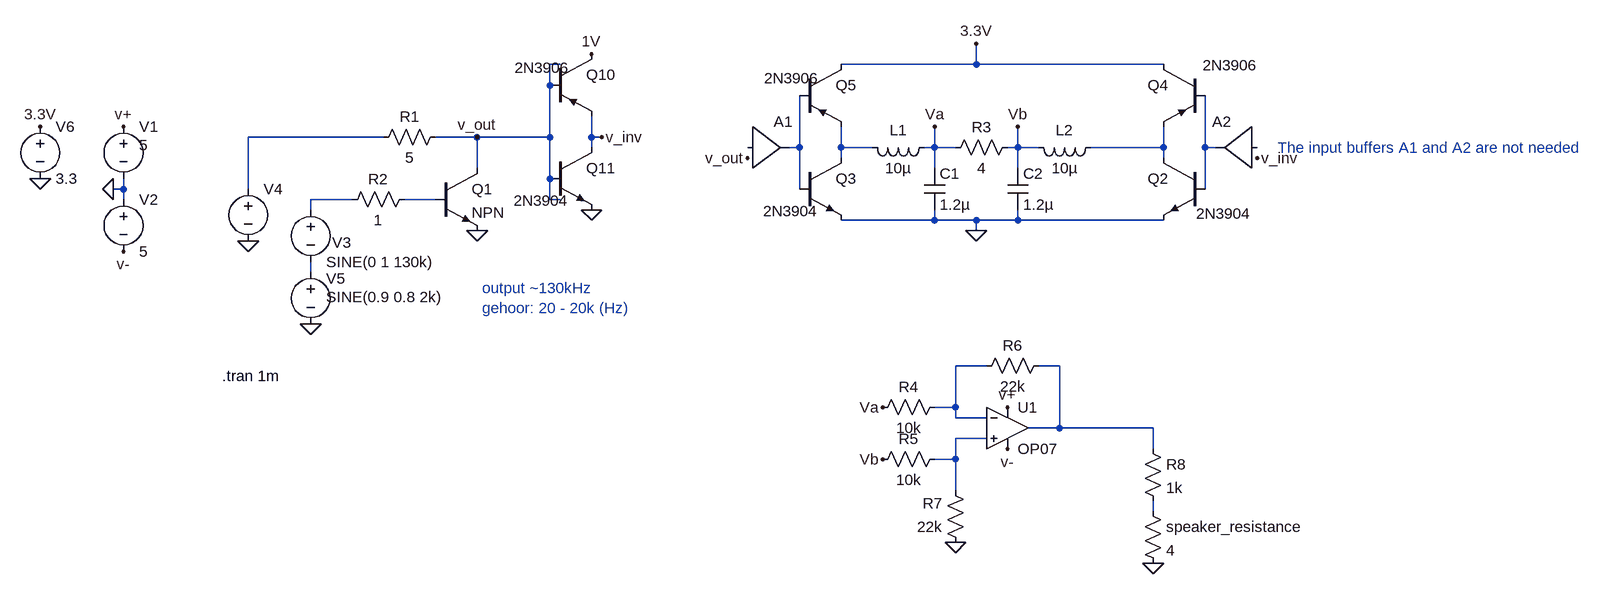
[diagram p0: schematic external filter voor speaker.asc]
external filter voor speaker.asc, the LTspice schematic file:
Version 4
SHEET 1 2196 708
WIRE 480 -144 464 -144
WIRE 1120 -144 1120 -176
WIRE 1120 -144 912 -144
WIRE 1408 -144 1120 -144
WIRE 464 -112 464 -144
WIRE 208 -32 0 -32
WIRE 352 -32 288 -32
WIRE 464 -32 464 -112
WIRE 464 -32 352 -32
WIRE 528 -32 528 -64
WIRE 544 -32 528 -32
WIRE 528 -16 528 -32
WIRE 848 -16 848 -96
WIRE 848 -16 832 -16
WIRE 912 -16 912 -48
WIRE 960 -16 912 -16
WIRE 1056 -16 1056 -48
WIRE 1056 -16 1040 -16
WIRE 1088 -16 1056 -16
WIRE 1184 -16 1184 -48
WIRE 1184 -16 1168 -16
WIRE 1216 -16 1184 -16
WIRE 1408 -16 1408 -48
WIRE 1408 -16 1296 -16
WIRE 1472 -16 1472 -96
WIRE 1488 -16 1472 -16
WIRE 912 0 912 -16
WIRE 1408 0 1408 -16
WIRE 352 16 352 -32
WIRE 1056 16 1056 -16
WIRE 1184 16 1184 -16
WIRE 464 32 464 -32
WIRE -192 48 -192 32
WIRE -192 48 -208 48
WIRE 0 48 0 -32
WIRE 848 48 848 -16
WIRE 1472 48 1472 -16
WIRE -192 64 -192 48
WIRE 160 64 96 64
WIRE 288 64 240 64
WIRE 464 64 464 32
WIRE 480 64 464 64
WIRE 96 80 96 64
WIRE 1056 96 1056 80
WIRE 1056 96 912 96
WIRE 1120 96 1056 96
WIRE 1184 96 1184 80
WIRE 1184 96 1120 96
WIRE 1408 96 1184 96
WIRE 1120 112 1120 96
WIRE 96 176 96 160
WIRE 1136 320 1088 320
WIRE 1248 320 1216 320
WIRE 1088 384 1088 320
WIRE 1088 384 1056 384
WIRE 1088 400 1088 384
WIRE 1136 400 1088 400
WIRE 1248 416 1248 320
WIRE 1248 416 1200 416
WIRE 1392 416 1248 416
WIRE 1136 432 1088 432
WIRE 1392 448 1392 416
WIRE 1088 464 1088 432
WIRE 1088 464 1056 464
WIRE 1088 512 1088 464
WIRE 1392 544 1392 528
FLAG -208 48 0
FLAG -192 -48 v+
FLAG -192 144 v-
FLAG 0 128 0
FLAG 352 112 0
FLAG 96 256 0
FLAG 1120 112 0
FLAG 528 80 0
FLAG 352 -32 v_out
FLAG 768 0 v_out
FLAG 544 -32 v_inv
FLAG 1552 0 v_inv
FLAG 1056 -48 Va
FLAG 1184 -48 Vb
FLAG -320 32 0
FLAG -320 -48 3.3V
FLAG 528 -160 1V
FLAG 1120 -176 3.3V
FLAG 1168 384 v+
FLAG 1168 448 v-
FLAG 1088 592 0
FLAG 976 384 Va
FLAG 976 464 Vb
FLAG 1392 624 0
SYMBOL voltage -192 -64 R0
WINDOW 3 24 44 Left 2
WINDOW 123 0 0 Left 0
WINDOW 39 0 0 Left 0
SYMATTR Value 5
SYMATTR InstName V1
SYMBOL voltage -192 48 R0
WINDOW 123 0 0 Left 0
WINDOW 39 0 0 Left 0
SYMATTR InstName V2
SYMATTR Value 5
SYMBOL voltage 96 64 R0
WINDOW 0 33 66 Left 2
WINDOW 123 0 0 Left 0
WINDOW 39 0 0 Left 0
SYMATTR InstName V3
SYMATTR Value SINE(0 1 130k)
SYMBOL voltage 0 32 R0
WINDOW 3 24 96 Invisible 2
WINDOW 123 0 0 Left 0
SYMATTR Value 4
SYMATTR InstName V4
SYMATTR SpiceLine Rser=0
SYMBOL npn 288 16 R0
SYMATTR InstName Q1
SYMBOL res 304 -48 R90
WINDOW 0 0 56 VBottom 2
WINDOW 3 32 56 VTop 2
SYMATTR InstName R1
SYMATTR Value 5
SYMBOL voltage 96 160 R0
WINDOW 123 0 0 Left 0
WINDOW 39 0 0 Left 0
WINDOW 0 24 26 Left 2
WINDOW 3 24 54 Left 2
SYMATTR InstName V5
SYMATTR Value SINE(0.9 0.8 2k)
SYMBOL res 256 48 R90
WINDOW 0 0 56 VBottom 2
WINDOW 3 32 56 VTop 2
SYMATTR InstName R2
SYMATTR Value 1
SYMBOL ind 1056 -32 R90
WINDOW 0 5 56 VBottom 2
WINDOW 3 32 56 VTop 2
SYMATTR InstName L1
SYMATTR Value 10µ
SYMATTR SpiceLine Rser=2
SYMBOL ind 1312 -32 R90
WINDOW 0 5 56 VBottom 2
WINDOW 3 32 56 VTop 2
SYMATTR InstName L2
SYMATTR Value 10µ
SYMATTR SpiceLine Rser=2
SYMBOL res 1184 -32 R90
WINDOW 0 0 56 VBottom 2
WINDOW 3 32 56 VTop 2
SYMATTR InstName R3
SYMATTR Value 4
SYMBOL cap 1040 16 R0
SYMATTR InstName C1
SYMATTR Value 1.2µ
SYMBOL cap 1168 16 R0
SYMATTR InstName C2
SYMATTR Value 1.2µ
SYMBOL npn 1472 0 M0
WINDOW 3 -71 86 Left 2
SYMATTR Value 2N3904
SYMATTR InstName Q2
SYMBOL npn 848 0 R0
WINDOW 3 -56 82 Left 2
SYMATTR Value 2N3904
SYMATTR InstName Q3
SYMBOL pnp 1472 -144 M0
WINDOW 3 -81 1 Left 2
SYMATTR Value 2N3906
SYMATTR InstName Q4
SYMBOL pnp 848 -144 R0
WINDOW 3 -54 21 Left 2
SYMATTR Value 2N3906
SYMATTR InstName Q5
SYMBOL pnp 464 -160 R0
WINDOW 3 -54 21 Left 2
SYMATTR Value 2N3906
SYMATTR InstName Q10
SYMBOL npn 464 -16 R0
WINDOW 3 -56 82 Left 2
SYMATTR Value 2N3904
SYMATTR InstName Q11
SYMBOL Digital\\buf1 768 -80 R0
SYMATTR InstName A1
SYMBOL Digital\\buf1 1552 -80 M0
SYMATTR InstName A2
SYMBOL voltage -320 -64 R0
WINDOW 123 0 0 Left 0
WINDOW 39 0 0 Left 0
SYMATTR InstName V6
SYMATTR Value 3.3
SYMBOL OpAmps\\OP07 1168 352 R0
SYMATTR InstName U1
SYMBOL res 1072 368 R90
WINDOW 0 0 56 VBottom 2
WINDOW 3 32 56 VTop 2
SYMATTR InstName R4
SYMATTR Value 10k
SYMBOL res 1072 448 R90
WINDOW 0 0 56 VBottom 2
WINDOW 3 32 56 VTop 2
SYMATTR InstName R5
SYMATTR Value 10k
SYMBOL res 1232 304 R90
WINDOW 0 0 56 VBottom 2
WINDOW 3 32 56 VTop 2
SYMATTR InstName R6
SYMATTR Value 22k
SYMBOL res 1104 608 R180
WINDOW 0 36 76 Left 2
WINDOW 3 36 40 Left 2
SYMATTR InstName R7
SYMATTR Value 22k
SYMBOL res 1376 432 R0
SYMATTR InstName R8
SYMATTR Value 1k
SYMBOL res 1376 528 R0
SYMATTR InstName speaker_resistance
SYMATTR Value 4
TEXT -40 336 Left 2 !.tran 1m
TEXT 360 200 Left 2 ;output ~130kHz\ngehoor: 20 - 20k (Hz)
TEXT 1584 -16 Left 2 ;The input buffers A1 and A2 are not needed

The netlist it stands for:
* external filter voor speaker.asc
V1 v+ 0 5
V2 0 v- 5
V3 N006 N008 SINE(0 1 130k)
V4 N001 0 4 Rser=0
Q1 v_out N007 0 0 NPN
R1 v_out N001 5
V5 N008 0 SINE(0.9 0.8 2k)
R2 N007 N006 1
L1 Va N003 10µ Rser=2
L2 N004 Vb 10µ Rser=2
R3 Vb Va 4
C1 Va 0 1.2µ
C2 Vb 0 1.2µ
Q2 N004 N005 0 0 2N3904
Q3 N003 N002 0 0 2N3904
Q4 3.3V N005 N004 0 2N3906
Q5 3.3V N002 N003 0 2N3906
Q10 1V v_out v_inv 0 2N3906
Q11 v_inv v_out 0 0 2N3904
A1 v_out v_out v_out v_out v_out v_out N002 v_out BUF
A2 v_inv v_inv v_inv v_inv v_inv v_inv N005 v_inv BUF
V6 3.3V 0 3.3
XU1 N011 N009 v+ v- N010 LT1001  ; OP07, pins In+ In- V+ V- OUT
R4 N009 Va 10k
R5 N011 Vb 10k
R6 N010 N009 22k
R7 0 N011 22k
R8 N010 N012 1k
R§speaker_resistance N012 0 4
.model NPN NPN
.model PNP PNP
.lib standard.bjt
.tran 1m
* output ~130kHz
* gehoor: 20 - 20k (Hz)
* The input buffers A1 and A2 are not needed
.lib LTC.lib
.backanno
.end